# Altium schematic sheet INA219AID.SchDoc
size A4
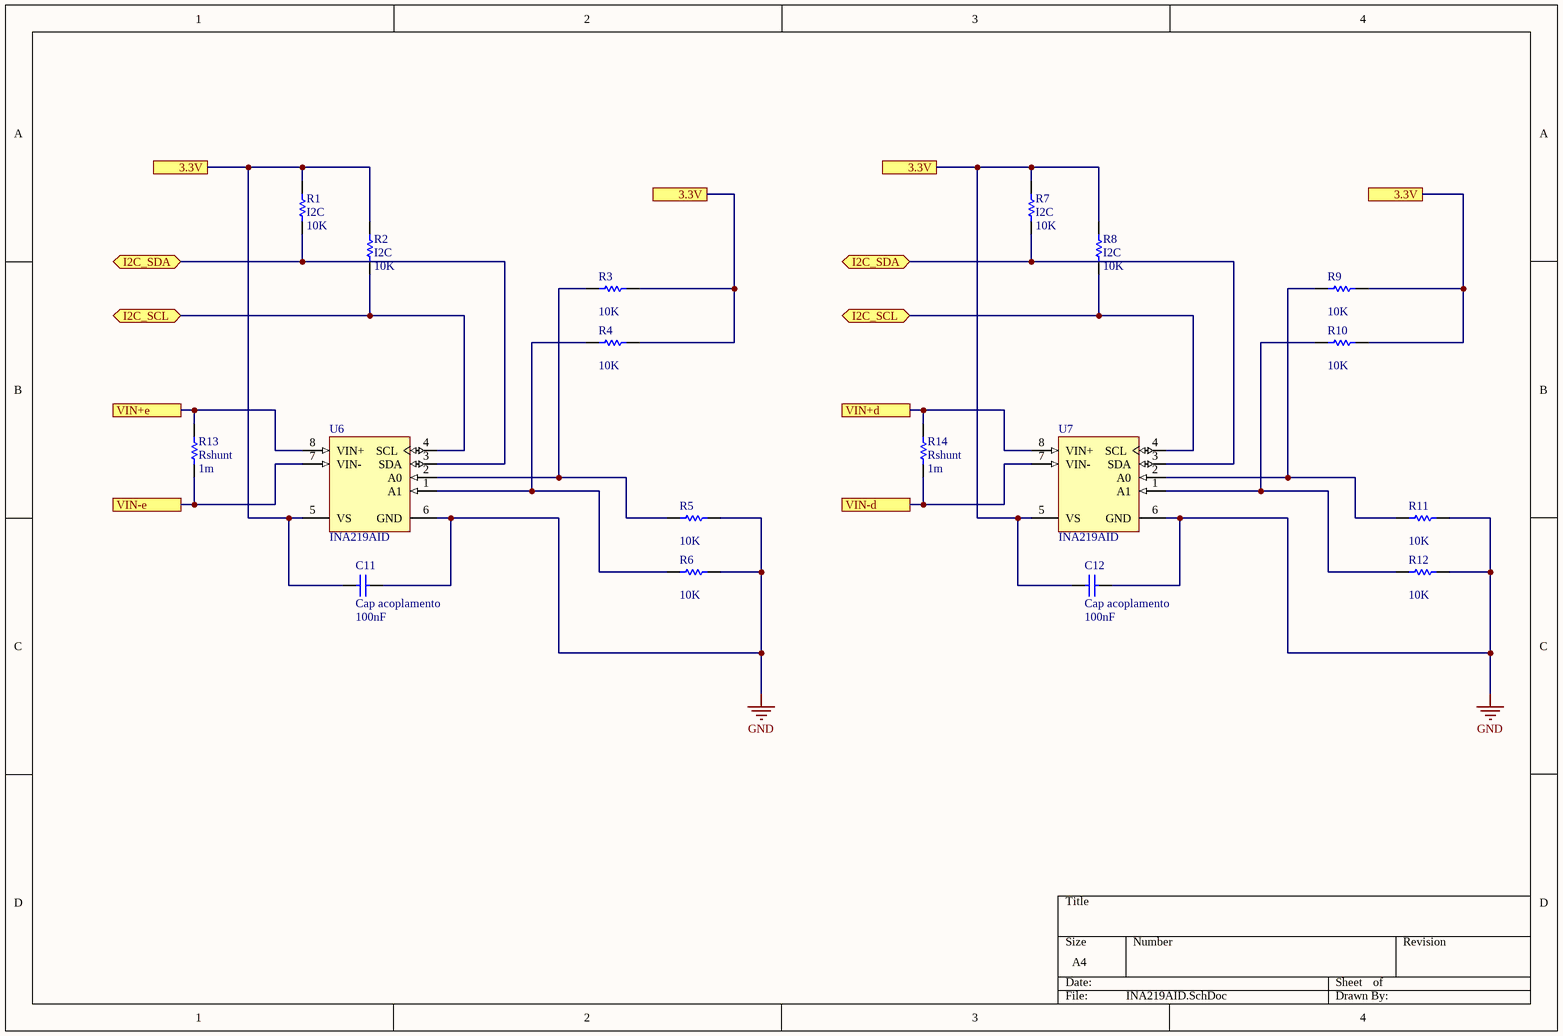
[diagram p0: INA219AID.SchDoc]

## Parts
C11  Cap acoplamento  value 100nF  [C1206]
C12  Cap acoplamento  value 100nF  [C1206]
R1  I2C  value 10K  [AXIAL-0.3]
R2  I2C  value 10K  [AXIAL-0.3]
R3  value 10K  [AXIAL-0.3]  (hidden comment: Res1)
R4  value 10K  [AXIAL-0.3]  (hidden comment: Res1)
R5  value 10K  [AXIAL-0.3]  (hidden comment: Res1)
R6  value 10K  [AXIAL-0.3]  (hidden comment: Res1)
R7  I2C  value 10K  [AXIAL-0.3]
R8  I2C  value 10K  [AXIAL-0.3]
R9  value 10K  [AXIAL-0.3]
R10  value 10K  [AXIAL-0.3]
R11  value 10K  [AXIAL-0.3]
R12  value 10K  [AXIAL-0.3]
R13  Rshunt  value 1m  [AXIAL-0.3]
R14  Rshunt  value 1m  [AXIAL-0.3]
U6  INA219AID  [D0008A_N]
U7  INA219AID  [D0008A_N]

## Ports
3.3V, I2C_SCL (bidir), I2C_SDA (bidir), VIN+d, VIN+e, VIN-d, VIN-e

## Nets
GND: C11.2 C12.2 R5.2 R6.2 R11.2 R12.2 U6.6(GND) U7.6(GND)
3.3V: C11.1 C12.1 R1.2 R2.2 R3.2 R4.2 R7.2 R8.2 R9.2 R10.2 U6.5(VS) U7.5(VS) ; port 3.3V
I2C_SCL: R2.1 R8.1 U6.4(SCL) U7.4(SCL) ; port I2C_SCL
I2C_SDA: R1.1 R7.1 U6.3(SDA) U7.3(SDA) ; port I2C_SDA
VIN+d: R14.2 U7.8(VIN+) ; port VIN+d
VIN+e: R13.2 U6.8(VIN+) ; port VIN+e
VIN-d: R14.1 U7.7(VIN-) ; port VIN-d
VIN-e: R13.1 U6.7(VIN-) ; port VIN-e
NetR3_1: R3.1 R5.1 U6.2(A0)
NetR4_1: R4.1 R6.1 U6.1(A1)
NetR9_1: R9.1 R11.1 U7.2(A0)
NetR10_1: R10.1 R12.1 U7.1(A1)

## Library data of the parts
C11 C12 = Cap Semi: Capacitor (Semiconductor SIM Model); Published: 8-Jun-2000; LatestRevisionDate: 29-May-2009; LatestRevisionNote: IPC-7351 Footprint Added.; PackageReference: C1206; Publisher: Altium Limited; PackageDescription: Chip Capacitor
R1-R14 = Res1: Resistor; Published: 8-Jun-2000; LatestRevisionDate: 17-Jul-2002; LatestRevisionNote: Re-released for DXP Platform.; PackageReference: AXIAL-0.3; Publisher: Altium Limited; PackageDescription: Axial Device, Thru-Hole; 2 Leads; 0.3 in Pin Spacing
U6 U7 = CMP-0704-00006-2: Zero-Drift, Bi-Directional Current / Power Monitor, 3 to 5.5 V, -40 to 125 degC, 8-pin SOIC (D8), Green (RoHS & no Sb/Br); Manufacturer: Texas Instruments; Vs(Max)(V): 5.5; Rating: Catalog; Gain(V/V): 1, 0.5, 0.25, 0.125; Vs(Min)(V): 3; Common Mode Range(Max)(V): 26; Input Offset (+/-)(Max)(uV): 100; Small-Signal Bandwidth(Typ)(MHz): 0.011; SubFamily: Current Shunt Monitor; Common Mode Range(Min)(V): 0; Quiescent Current (+/-)(Typ)(mA): 0.7; PartNumber: INA219AID; ComponentLink2Description: Datasheet; PackageVersion: 4040047-3/M, 06/2011; ComponentLink3Description: Package Specification; Mounting Technology: Surface Mount; ComponentLink2URL: http://www.ti.com/general/docs/lit/getliterature.tsp?genericPartNumber=INA219&fileType=pdf; Eco-Plan: Green (RoHS & no Sb/Br); DatasheetVersion: SBOS448F; Code_JEDEC: MS-012; PackageDescription: 8-Pin Plastic Small Outline, Body 4.9 x 3.9 mm, Pitch 1.27 mm; ComponentLink1Description: Manufacturer URL; ComponentLink1URL: http://www.ti.com/; PackageReference: D0008A; ComponentLink3URL: http://www.ti.com/lit/ml/msoi002j/msoi002j.pdf; CMRR(Min)(dB): 100